# Altium schematic sheet RPi Bowler Port.SchDoc
size A
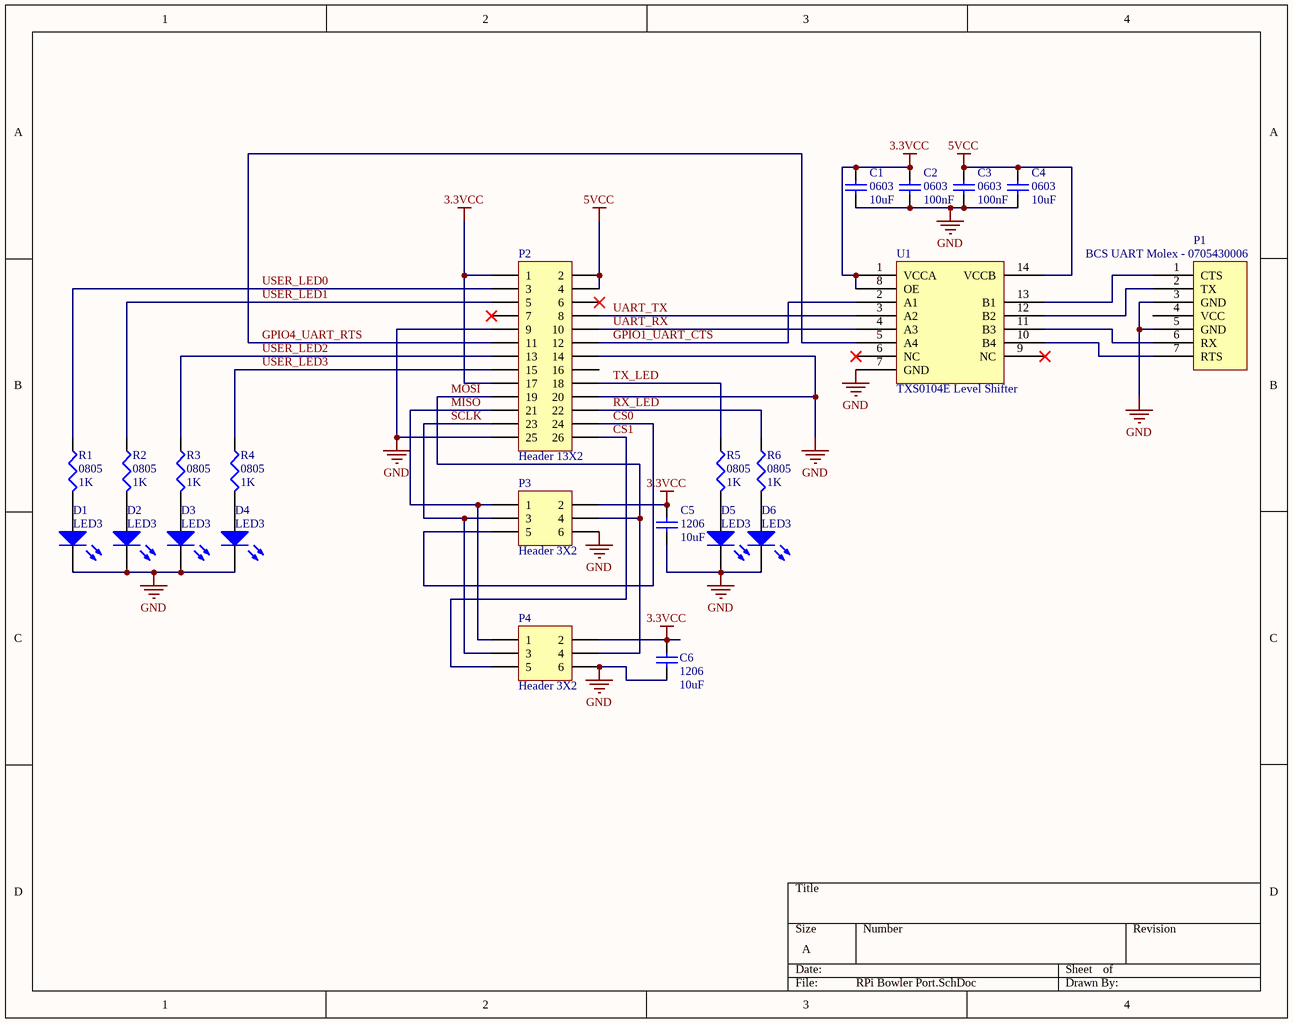
[diagram p0: RPi Bowler Port.SchDoc]

## Parts
C1  0603  value 10uF  [1608[0603]]
C2  0603  value 100nF  [1608[0603]]
C3  0603  value 100nF  [1608[0603]]
C4  0603  value 10uF  [1608[0603]]
C5  1206  value 10uF  [C1206]
C6  1206  value 10uF  [C1206]
D1  LED3  [SM 0805 polarized]
D2  LED3  [SM 0805 polarized]
D3  LED3  [SM 0805 polarized]
D4  LED3  [SM 0805 polarized]
D5  LED3  [SM 0805 polarized]
D6  LED3  [SM 0805 polarized]
P1  BCS UART Molex - 0705430006  [BCS Serial Port - Molex]
P2  Header 13X2  [HDR2X13]
P3  Header 3X2  [HDR2X3]
P4  Header 3X2  [HDR2X3]
R1  0805  value 1K  [SM 0805 - gap trimmed]
R2  0805  value 1K  [SM 0805 - gap trimmed]
R3  0805  value 1K  [SM 0805 - gap trimmed]
R4  0805  value 1K  [SM 0805 - gap trimmed]
R5  0805  value 1K  [SM 0805 - gap trimmed]
R6  0805  value 1K  [SM 0805 - gap trimmed]
U1  TXS0104E Level Shifter  [RGY  (S-PVQFN-N14)]

## Nets
3.3VCC: C1.2 C2.2 C5.2 C6.2 P2.1 P2.17 P3.2 P4.2 U1.1(VCCA) U1.8(OE)
5VCC: C3.2 C4.2 P2.2 P2.4 U1.14(VCCB)
GND: C1.1 C2.1 C3.1 C4.1 C5.1 C6.1 D1.1(A) D2.1(A) D3.1(A) D4.1(A) D5.1(A) D6.1(A) P1.3(GND) P1.5(GND) P2.9 P2.14 P2.20 P2.25 P3.6 P4.6 U1.7(GND)
CS0: P2.24 P3.5
CS1: P2.26 P4.5
GPIO1_UART_CTS: P2.12 U1.2(A1)
GPIO4_UART_RTS: P2.11 U1.5(A4)
MISO: P2.21 P3.1 P4.1
MOSI: P2.19 P3.4 P4.4
RX_LED: P2.22 R6.1
SCLK: P2.23 P3.3 P4.3
TX_LED: P2.18 R5.1
UART_RX: P2.10 U1.4(A3)
UART_TX: P2.8 U1.3(A2)
USER_LED0: P2.3 R1.1
USER_LED1: P2.5 R2.1
USER_LED2: P2.13 R3.1
USER_LED3: P2.15 R4.1
NetD1_2: D1.2(K) R1.2
NetD2_2: D2.2(K) R2.2
NetD3_2: D3.2(K) R3.2
NetD4_2: D4.2(K) R4.2
NetD5_2: D5.2(K) R5.2
NetD6_2: D6.2(K) R6.2
NetP1_1: P1.1(CTS) U1.13(B1)
NetP1_2: P1.2(TX) U1.12(B2)
NetP1_6: P1.6(RX) U1.11(B3)
NetP1_7: P1.7(RTS) U1.10(B4)

Not connected (* = marked no-connect by the designer): P1 4(VCC); P2 6* 7* 16; U1 6(NC)* 9(NC)*

## Library data of the parts
C1-C6 = Cap Semi: Capacitor (Semiconductor SIM Model); Published: 8-Jun-2000; LatestRevisionDate: 29-May-2009; LatestRevisionNote: IPC-7351 Footprint Added.; PackageReference: C1206; Publisher: Altium Limited; PackageDescription: Chip Capacitor
D1-D6 = LED3: Typical BLUE SiC LED; Published: 8-Jun-2000; LatestRevisionDate: 17-Dec-2003; LatestRevisionNote: PCB Footprint replaced.; DatasheetVersion: 16-Apr-2002; PackageVersion: 16-Apr-2002; PackageReference: 3.5X2.8X1.9; Publisher: Altium Limited; PackageDescription: SM LED; 2 C-Bend Leads; Body 3.5 x 2.8 x 1.9 mm, inc leads (LxWxH typ)
P1 = BCS Serial Port - Molex: BCS UART Port Molex
P2 = Header 13X2: Header, 13-Pin, Dual row; LatestRevisionDate: 17-Jul-2002; LatestRevisionNote: Re-released for DXP Platform.; Publisher: Altium Limited
P3 P4 = Header 3X2: Header, 3-Pin, Dual row; LatestRevisionDate: 17-Jul-2002; LatestRevisionNote: Re-released for DXP Platform.; Publisher: Altium Limited
R1-R6 = Res3: Resistor; Published: 8-Jun-2000; LatestRevisionDate: 29-May-2009; LatestRevisionNote: IPC-7351 Footprint Added.; PackageReference: J1-0603; Publisher: Altium Limited; PackageDescription: Chip Resistor
U1 = TXS0104E: TXS0104E - Bidriectional Opendrain/pushpull level shift